# Altium schematic sheet HEADERS_UNO.SchDoc: HEADERS UNO
size A3; Author: Silvio Navaretti; CompanyName: ARDUINO; DrawnBy: Silvio Navaretti; Engineer: Silvio Navaretti; Organization: ARDUINO; SheetNumber: 19; SheetTotal: 51; RevAuthor: Silvio Navaretti
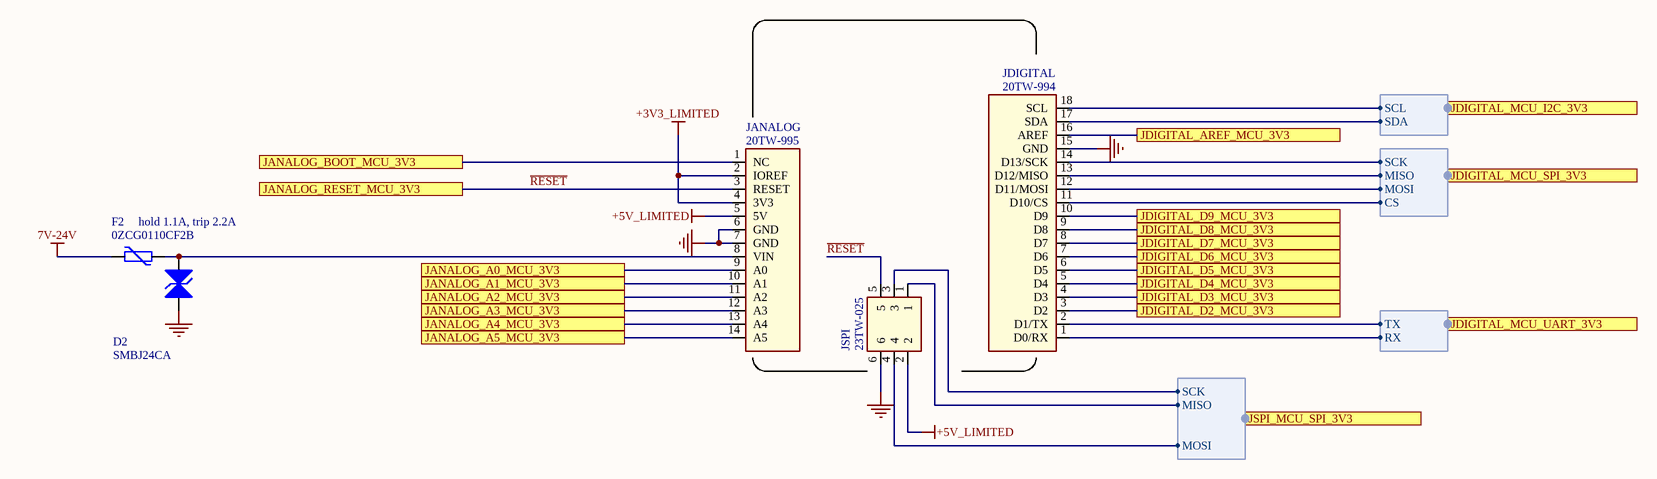
[diagram p0: HEADERS_UNO.SchDoc]

## Parts
D2  SMBJ24CA  [SMB_NOPOLARITY]
F2  0ZCG0110CF2B  [1812]
JANALOG  20TW-995  [1X14-CUSTOM]
JDIGITAL  20TW-994  [1X18-CUSTOM]
JSPI  23TW-025  [23TW-025]

## Ports
JANALOG_A0_MCU_3V3, JANALOG_A1_MCU_3V3, JANALOG_A2_MCU_3V3, JANALOG_A3_MCU_3V3, JANALOG_A4_MCU_3V3, JANALOG_A5_MCU_3V3, JANALOG_BOOT_MCU_3V3, JANALOG_RESET_MCU_3V3, JDIGITAL_AREF_MCU_3V3, JDIGITAL_D2_MCU_3V3, JDIGITAL_D3_MCU_3V3, JDIGITAL_D4_MCU_3V3, JDIGITAL_D5_MCU_3V3, JDIGITAL_D6_MCU_3V3, JDIGITAL_D7_MCU_3V3, JDIGITAL_D8_MCU_3V3, JDIGITAL_D9_MCU_3V3, JDIGITAL_MCU_I2C_3V3 (harness I2C), JDIGITAL_MCU_SPI_3V3 (harness SPI), JDIGITAL_MCU_UART_3V3 (harness UART), JSPI_MCU_SPI_3V3 (harness JSPI_SPI)

## Harnesses
SPI: SCK, MISO, MOSI, CS
UART: TX, RX
I2C: SDA, SCL
JSPI_SPI: SCK, MISO, MOSI

## Nets
7V-24V: F2.1
+3V3_LIMITED: JANALOG.2(IOREF) JANALOG.4(3V3)
+5V_LIMITED: JANALOG.5(5V) JSPI.2
GND: D2.1(A1) JANALOG.6(GND) JANALOG.7(GND) JDIGITAL.15(GND) JSPI.6
JANALOG_A0_MCU_3V3: JANALOG.9(A0) ; port JANALOG_A0_MCU_3V3
JANALOG_A1_MCU_3V3: JANALOG.10(A1) ; port JANALOG_A1_MCU_3V3
JANALOG_A2_MCU_3V3: JANALOG.11(A2) ; port JANALOG_A2_MCU_3V3
JANALOG_A3_MCU_3V3: JANALOG.12(A3) ; port JANALOG_A3_MCU_3V3
JANALOG_A4_MCU_3V3: JANALOG.13(A4) ; port JANALOG_A4_MCU_3V3
JANALOG_A5_MCU_3V3: JANALOG.14(A5) ; port JANALOG_A5_MCU_3V3
JANALOG_BOOT_MCU_3V3: JANALOG.1(NC) ; port JANALOG_BOOT_MCU_3V3
JDIGITAL_AREF_MCU_3V3: JDIGITAL.16(AREF) ; port JDIGITAL_AREF_MCU_3V3
JDIGITAL_D2_MCU_3V3: JDIGITAL.3(D2) ; port JDIGITAL_D2_MCU_3V3
JDIGITAL_D3_MCU_3V3: JDIGITAL.4(D3) ; port JDIGITAL_D3_MCU_3V3
JDIGITAL_D4_MCU_3V3: JDIGITAL.5(D4) ; port JDIGITAL_D4_MCU_3V3
JDIGITAL_D5_MCU_3V3: JDIGITAL.6(D5) ; port JDIGITAL_D5_MCU_3V3
JDIGITAL_D6_MCU_3V3: JDIGITAL.7(D6) ; port JDIGITAL_D6_MCU_3V3
JDIGITAL_D7_MCU_3V3: JDIGITAL.8(D7) ; port JDIGITAL_D7_MCU_3V3
JDIGITAL_D8_MCU_3V3: JDIGITAL.9(D8) ; port JDIGITAL_D8_MCU_3V3
JDIGITAL_D9_MCU_3V3: JDIGITAL.10(D9) ; port JDIGITAL_D9_MCU_3V3
~{RESET}: JANALOG.3(RESET) JSPI.5 ; port JANALOG_RESET_MCU_3V3
NetD2_2: D2.2(A2) F2.2 JANALOG.8(VIN)
NetJDIGITAL_1: JDIGITAL.1(D0/RX) ; port JDIGITAL_MCU_UART_3V3.RX
NetJDIGITAL_2: JDIGITAL.2(D1/TX) ; port JDIGITAL_MCU_UART_3V3.TX
NetJDIGITAL_11: JDIGITAL.11(D10/CS) ; port JDIGITAL_MCU_SPI_3V3.CS
NetJDIGITAL_12: JDIGITAL.12(D11/MOSI) ; port JDIGITAL_MCU_SPI_3V3.MOSI
NetJDIGITAL_13: JDIGITAL.13(D12/MISO) ; port JDIGITAL_MCU_SPI_3V3.MISO
NetJDIGITAL_14: JDIGITAL.14(D13/SCK) ; port JDIGITAL_MCU_SPI_3V3.SCK
NetJDIGITAL_17: JDIGITAL.17(SDA) ; port JDIGITAL_MCU_I2C_3V3.SDA
NetJDIGITAL_18: JDIGITAL.18(SCL) ; port JDIGITAL_MCU_I2C_3V3.SCL
NetJSPI_1: JSPI.1 ; port JSPI_MCU_SPI_3V3.MISO
NetJSPI_3: JSPI.3 ; port JSPI_MCU_SPI_3V3.SCK
NetJSPI_4: JSPI.4 ; port JSPI_MCU_SPI_3V3.MOSI

## Notes on the sheet
- hold 1.1A, trip 2.2A
- Title:
- ID:
- Date:
- Time:
- Version:
- Sheet
- of
- RevAuthor:
- Reference Designs ARE PROVIDED "AS IS" AND "WITH ALL FAULTS. Arduino SA DISCLAIMS ALL OTHER WARRANTIES, EXPRESS OR IMPLIED, REGARDING PRODUCTS, INCLUDING BUT NOT LIMITED TO, ANY IMPLIED WARRANTIES OF MERCHANTABILITY OR FITNESS FOR A PARTICULAR PURPOSE.
  Arduino SA may make changes to specifications and product descriptions at any time, without notice. The Customer must not rely on the absence or characteristics of any features or instructions marked "reserved" or "undefined".
  Arduino SA reserves these for future definition and shall have no responsibility whatsoever for conflicts or incompatibilities arising from future changes to them. The product information on the Web Site or Materials is subject to change without notice.
  Do not finalize a design with this info. ARDUINO and other Arduino brands and logos and Trademarks of Arduino SA. All Arduino SA Trademarks cannot be used without owner's formal permission.
- File:
- Author:

## Library data of the parts
D2 = D0070-A.2: TVS BIDIRECTIONAL SMD Vr 24V, Vbr min 26.7V, 600W, SMB; Manufacturer: Littlefuse; V(BR) Typ (V): 26.7; Code Arduino: D0070; Manufacturer 2: Bourns; Part Number: SMBJ24CA; Manufacturer 3: Hottech
F2 = P0027-A.1: PTC Ihold 1.1A Itrip 2.2A 33V 1812; Manufacturer: Bel Fuse; Code Arduino: P0027; Part Number: 0ZCG0110CF2B
JANALOG = J0063-A.10: JANALOG UNO header 2.54mm with 8+6 pins, custom 5.08mm pitch between them, custom silkscreen print on side; Manufacturer: 4UCONN; Code Arduino: 3649; Part Number: 20TW-995
JDIGITAL = J0035-A.13: JDIGITAL UNO header 2.54mm with 8+10 pins, custom 4.06mm pitch between them, custom silkscreen print on side; Manufacturer: 4UCONN; Code Arduino: 3648; Part Number: 20TW-994
JSPI = J0569-A.3: CONN HEADER MALE 6POS 2x3 2.54mm SMD; Manufacturer: 4UCONN; Number of Contacts: 6; Code Arduino: J0569; Part Number: 23TW-025